# Altium schematic sheet Rover_PI_hat.SchDoc
size A; Author: Hannah Cho; DrawnBy: Hannah Cho; SheetNumber: 1; SheetTotal: 1
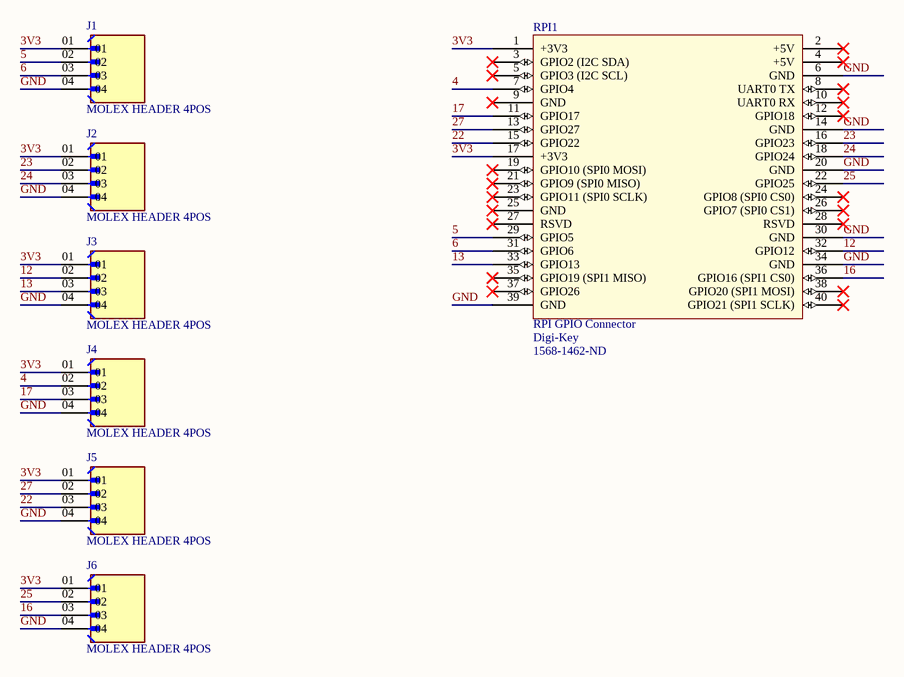
[diagram p0: Rover_PI_hat.SchDoc]

## Parts
J1  MOLEX HEADER 4POS  [MOLEX_35362-0450]
J2  MOLEX HEADER 4POS  [MOLEX_35362-0450]
J3  MOLEX HEADER 4POS  [MOLEX_35362-0450]
J4  MOLEX HEADER 4POS  [MOLEX_35362-0450]
J5  MOLEX HEADER 4POS  [MOLEX_35362-0450]
J6  MOLEX HEADER 4POS  [MOLEX_35362-0450]
RPI1  RPI GPIO Connector  Supplier 1: Digi-Key  Supplier Part Number 1: 1568-1462-ND  [rpi]

## Nets
3V3: J1.01 J2.01 J3.01 J4.01 J5.01 J6.01 RPI1.1(+3V3) RPI1.17(+3V3)
4: J4.02 RPI1.7(GPIO4)
5: J1.02 RPI1.29(GPIO5)
6: J1.03 RPI1.31(GPIO6)
12: J3.02 RPI1.32(GPIO12)
13: J3.03 RPI1.33(GPIO13)
16: J6.03 RPI1.36(GPIO16_(SPI1_CS0))
17: J4.03 RPI1.11(GPIO17)
22: J5.03 RPI1.15(GPIO22)
23: J2.02 RPI1.16(GPIO23)
24: J2.03 RPI1.18(GPIO24)
25: J6.02 RPI1.22(GPIO25)
27: J5.02 RPI1.13(GPIO27)
GND: J1.04 J2.04 J3.04 J4.04 J5.04 J6.04 RPI1.6(GND) RPI1.14(GND) RPI1.20(GND) RPI1.30(GND) RPI1.34(GND) RPI1.39(GND)

Not connected (* = marked no-connect by the designer): RPI1 2(+5V)* 3(GPIO2_(I2C_SDA))* 4(+5V)* 5(GPIO3_(I2C_SCL))* 8(UART0_TX)* 9(GND)* 10(UART0_RX)* 12(GPIO18)* 19(GPIO10_(SPI0_MOSI))* 21(GPIO9_(SPI0_MISO))* 23(GPIO11_(SPI0_SCLK))* 24(GPIO8_(SPI0_CS0))* 25(GND)* 26(GPIO7_(SPI0_CS1))* 27(RSVD)* 28(RSVD)* 35(GPIO19_(SPI1_MISO))* 37(GPIO26)* 38(GPIO20_(SPI1_MOSI))* 40(GPIO21_(SPI1_SCLK))*

## Library data of the parts
J1-J6 = 35362-0450: Connector Header Through Hole 4 position 0.079 (2.00mm); SnapEDA_Link: https://www.snapeda.com/parts/35362-0450/Molex/view-part/?ref=snap; Availability: In Stock; MP: 35362-0450; Price: None; Value: *; Check_prices: https://www.snapeda.com/parts/35362-0450/Molex/view-part/?ref=eda; MF: Molex; Package: None
RPI1 = rpi connector: GPIO Header for Raspberry Pi A+/B+/Pi 2/Pi 3 - 2x20; Manufacturer: SparkFun Electronics; Manufacturer Part Number: PRT-14017; Nils Minor: author; nilsminor@web.de: mail; RoHS: RoHS Compliant; Category: Development Boards, Kits, Programmers; Stock 1: 150; Pricing 1: 1=1.84 (EUR); Part Status: Active; Accessory Type: Connector; For Use With/Related Products: Raspberry Pi; ComponentLink1URL: https://cdn.sparkfun.com/datasheets/Dev/RaspberryPi/12313.pdf; ComponentLink1Description: https://cdn.sparkfun.com/datasheets/Dev/RaspberryPi/12313.pdf